# Altium schematic sheet 02 - EnergyManagementUnit.SchDoc: Energy Management Unit
size A4; DrawnBy: LS, OB, AB, AG, IM; Organization: Miromico; Revision: 3; SheetNumber: 3; SheetTotal: 5; SchemaTitle: Energy Management Unit
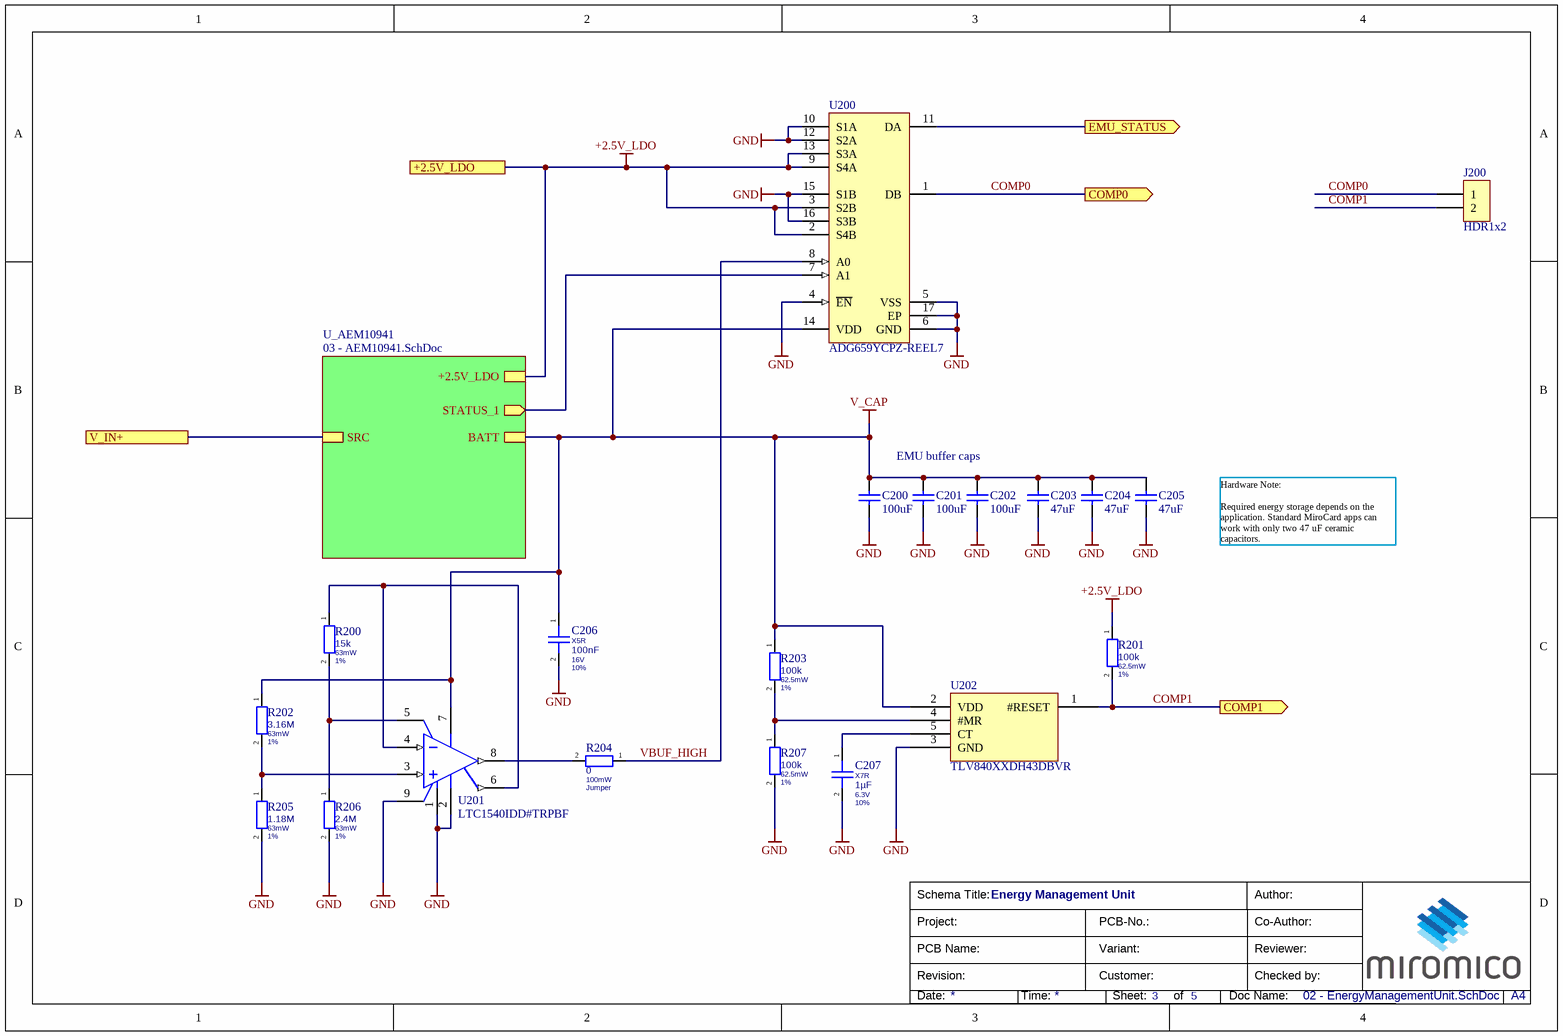
[diagram p0: 02 - EnergyManagementUnit.SchDoc]

## Parts
C200  value 100uF  [CAPC1206(3216)145_N]  (hidden comment: CAP 100uF 10V 1206(3216))
C201  value 100uF  [CAPC1206(3216)145_N]  (hidden comment: CAP 100uF 10V 1206(3216))
C202  value 100uF  [CAPC1206(3216)145_N]  (hidden comment: CAP 100uF 10V 1206(3216))
C203  value 47uF  [CAPC0805(2012)95_L]  (hidden comment: CAP 47uF 6.3V 0805(2012))
C204  value 47uF  [CAPC0805(2012)95_L]  (hidden comment: CAP 47uF 6.3V 0805(2012))
C205  value 47uF  [CAPC0805(2012)95_L]  (hidden comment: CAP 47uF 6.3V 0805(2012))
C206  Dielectric: X5R  Capacitance: 100nF  Voltage Rating: 16V  Tolerance: 10%  [CAPC0402(1005)60_L]  (hidden comment: GRM155R61C104KA88D)
C207  Dielectric: X7R  Capacitance: 1µF  Voltage Rating: 6.3V  Tolerance: 10%  [CAPC0402(1005)60_L]  (hidden comment: GRM155R70J105KA12J)
J200  HDR1x2  [HDR1x2]
R200  Resistance: 15k  Power Rating: 63mW  Tolerance: 1%  [RESC0402(1005)_L]  (hidden comment: PFR05S-153-FNH)
R201  Resistance: 100k  Power Rating: 62.5mW  Tolerance: 1%  [RESC0402(1005)_L]  (hidden comment: RMCF0402FT100K)
R202  Resistance: 3.16M  Power Rating: 63mW  Tolerance: 1%  [RESC0402(1005)_L]  (hidden comment: CRCW04023M16FKED)
R203  Resistance: 100k  Power Rating: 62.5mW  Tolerance: 1%  [RESC0402(1005)_L]  (hidden comment: RMCF0402FT100K)
R204  Resistance: 0  Power Rating: 100mW  Tolerance: Jumper  [RESC0603(1608)_L]  (hidden comment: RMCF0603ZT0R00)
R205  Resistance: 1.18M  Power Rating: 63mW  Tolerance: 1%  [RESC0402(1005)_L]  (hidden comment: RMCF0402FT1M18)
R206  Resistance: 2.4M  Power Rating: 63mW  Tolerance: 1%  [RESC0402(1005)_L]  (hidden comment: RMCF0402FT2M40)
R207  Resistance: 100k  Power Rating: 62.5mW  Tolerance: 1%  [RESC0402(1005)_L]  (hidden comment: RMCF0402FT100K)
U200  ADG659YCPZ-REEL7  [CP-16-4_L]
U201  LTC1540IDD#TRPBF  [LT-DD8_V]
U202  TLV840XXDH43DBVR  [SOT23-5 SOT-23-5]

## Sub-sheets
U_AEM10941 = 03 - AEM10941.SchDoc: STATUS_1 (out), SRC, +2.5V_LDO, BATT

## Ports
+2.5V_LDO, COMP0 (out), COMP1 (out), EMU_STATUS (out), V_IN+

## Nets
+2.5V_LDO: R201.1 U200.2(S4B) U200.3(S2B) U200.9(S4A) U200.13(S3A) ; port +2.5V_LDO, sheet U_AEM10941/+2.5V_LDO
GND: C200.1 C201.1 C202.1 C203.2 C204.2 C205.2 C206.2 C207.2 R205.2 R206.2 R207.2 U200.4(~{EN}) U200.5(VSS) U200.6(GND) U200.10(S1A) U200.12(S2A) U200.15(S1B) U200.16(S3B) U200.17(EP) U201.1(GND) U201.2(V-) U201.9(EP) U202.3(GND)
V_CAP: C200.2 C201.2 C202.2 C203.1 C204.1 C205.1 C206.1 R202.1 R203.1 U200.14(VDD) U201.7(V+) U202.2(VDD) ; sheet U_AEM10941/BATT
COMP0: J200.1 U200.1(DB) ; port COMP0
COMP1: J200.2 R201.2 U202.1(#RESET) ; port COMP1
EMU_STATUS: U200.11(DA) ; port EMU_STATUS
V_IN+: port V_IN+, sheet U_AEM10941/SRC
VBUF_HIGH: R204.1 U200.8(A0)
NetC207_1: C207.1 U202.5(CT)
NetR200_1: R200.1 U201.4(IN-) U201.6(REF)
NetR200_2: R200.2 R206.1 U201.5(HYST)
NetR202_2: R202.2 R205.1 U201.3(IN+)
NetR203_2: R203.2 R207.1 U202.4(#MR)
NetR204_2: R204.2 U201.8(OUT)
NetU200_7: U200.7(A1) ; sheet U_AEM10941/STATUS_1

## Notes on the sheet
- EMU buffer caps
- Hardware Note:
  Required energy storage depends on the application. Standard MiroCard apps can work with only two 47 uF ceramic capacitors.
- Schema Title:
- Project:
- PCB-No.:
- Author:
- Co-Author:
- Revision:
- PCB Name:
- Customer:
- Variant:
- Reviewer:
- Checked by:
- Date:
- Time:
- Sheet:
- of
- Doc Name:
- A4

## Library data of the parts
C200-C202 = CMP-LMK316BBJ107ML-T: CAP 100uF 10V ±20% 1206 (3216 Metric) Thickness 1.45mm SMD; Tolerance: Â±20%; Case-EIA: 1206; Case-Metric: 3216; Rated Voltage: 10 V; Technology: SMT; Max Thickness: 1.45 mm
C203-C205 = CMP-GRM219R60J476ME44D : CAP 47uF 6.3V ±20% 0805 (2012 Metric) Thickness 0.95mm SMD; Tolerance: Â±20%; Case-EIA: 0805; Case-Metric: 2012; Rated Voltage: 6.3 V; Technology: SMT; Max Thickness: 0.95 mm
C206 = CMP-00416-01: 0.1µF ±10% 16V Ceramic Capacitor X5R 0402 (1005 Metric); Manufacturer: Murata Electronics; ComponentLink1Description: Datasheet; Manufacturer Part Number: GRM155R61C104KA88D; Supplier 1: Digi-Key; Supplier Part Number 1: 490-5415-1-ND; Mount: Surface Mount; Case/Package: 0402; Case Code (Metric): 1005; Case Code (Imperial): 0402; Min Operating Temperature: -55°C; Max Operating Temperature: 85°C; Package Quantity: 1; Packaging: Tape and Reel; Termination: SMD/SMT; Voltage: 16V; Voltage Rating (DC): 16V; Length: 1mm; Width: 0.02inch; Height: 0.5mm; Thickness: 0.022inch; Depth: 0.5mm; Radiation Hardening: No; REACH SVHC: No SVHC; Lead Free: Lead Free
C207 = CMP-00441-03: 1µF ±10% 6.3V Ceramic Capacitor X7R 0402 (1005 Metric); Manufacturer: Murata Electronics; ComponentLink1Description: Datasheet; Manufacturer Part Number: GRM155R70J105KA12J; Supplier 1: Digi-Key; Supplier Part Number 1: 490-13339-1-ND; Mount: Surface Mount; Case/Package: 0402; Case Code (Metric): 1005; Case Code (Imperial): 0402; Weight: 0.000212oz; Min Operating Temperature: -55°C; Max Operating Temperature: 125°C; Packaging: Tape and Reel; Termination: SMD/SMT; Voltage Rating (DC): 6.3V; Package Quantity: 50000; Length: 0.039inch; Width: 0.02inch; Thickness: 0.022inch
J200 = HDR1x2-01: 1x2 Pin Header, 2.54mm; Properties: 1x2 Pin Terminal Header, 2.54mm; SchLibComponentName: HDR1x2
R200 = CMP-00468-01: 15 kOhms ±1% 0.063W, 1/16W Chip Resistor 0402 (1005 Metric)  Thick Film; Manufacturer: Delta Electronics/Cyntec; ComponentLink1Description: Datasheet; ComponentLink1URL: http://www.cyntec.com/upfile/products/download/RH000000NH%20_A3_PFR05.pdf; Manufacturer Part Number: PFR05S-153-FNH; Supplier 1: Digi-Key; Supplier Part Number 1: 2037-PFR05S-153-FNHCT-ND
R201 R203 R207 = CMP-00463-01: 100 kOhms ±1% 0,063W, 1/16W Chipwiderstand 0402 (1005 metrisch) AutomobilzulassungAEC-Q200 Dickschicht; Manufacturer: Stackpole Electronics Inc; Temperature Coefficient: 100ppm/°C; Max Power Dissipation: 63mW; ComponentLink1Description: Datasheet; ComponentLink1URL: https://www.seielect.com/catalog/sei-rmcf_rmcp.pdf; Manufacturer Part Number: RMCF0402FT100K; Supplier 1: Digi-Key; Supplier Part Number 1: RMCF0402FT100KCT-ND; Mount: Surface Mount; Case/Package: 0402; Case Code (Metric): 1005; Case Code (Imperial): 0402; Contact Plating: Tin,Matte; Min Operating Temperature: -55°C; Max Operating Temperature: 155°C; Packaging: Tape and Reel; Resistor Type: Thick Film; Number of Terminations: 2; Features: Automotive AEC-Q200; Length: 1mm; Width: 0.02inch; Height: 0.016inch; Depth: 0.5mm; Radiation Hardening: No; Military Standard: Not; Lead Free: Lead Free
R202 = CMP-00469-01: 3.16 MOhms ±1% 0.063W, 1/16W Chip Resistor 0402 (1005 Metric) Automotive AEC-Q200 Thick Film; Manufacturer: Vishay Dale; Voltage Rating: 50V; Temperature Coefficient: 100ppm/°C; ComponentLink1Description: Datasheet; ComponentLink1URL: https://www.vishay.com/docs/20035/dcrcwe3.pdf; Manufacturer Part Number: CRCW04023M16FKED; Supplier 1: Digi-Key; Supplier Part Number 1: 541-3.16MLCT-ND; Case/Package: 0402; Number of Pins: 2; Weight: 2.3E-05oz; Case Code (Metric): 1005; Case Code (Imperial): 0402; Contact Plating: Tin; Min Operating Temperature: -55°C; Max Operating Temperature: 155°C; Package Quantity: 10000; Packaging: Tape and Reel; Resistor Type: Thick Film; Number of Terminations: 2; Termination: SMD/SMT; Max Power Dissipation: 63mW; Voltage Rating (DC): 50V; Features: Automotive AEC-Q200; Length: 1mm; Width: 0.02inch; Height: 0.016inch; Depth: 0.5mm; Radiation Hardening: No; REACH SVHC: Unknown; Military Standard: Not; Lead Free: Lead Free
R204 = CMP-00472-01: 0 Ohms Jumper 0.1W, 1/10W Chip Resistor 0603 (1608 Metric) Automotive AEC-Q200 Thick Film; Manufacturer: Stackpole Electronics Inc; Current Rating: 1A; Working Voltage: 75V; ComponentLink1Description: Datasheet; ComponentLink1URL: https://www.seielect.com/catalog/sei-rmcf_rmcp.pdf; Manufacturer Part Number: RMCF0603ZT0R00; Supplier 1: Digi-Key; Supplier Part Number 1: RMCF0603ZT0R00CT-ND; Mount: Surface Mount; Case/Package: 0603; Case Code (Metric): 1608; Case Code (Imperial): 0603; Contact Plating: Tin,Matte; Min Operating Temperature: -55°C; Max Operating Temperature: 155°C; Packaging: Tape and Reel; Resistor Type: Thick Film; Number of Terminations: 2; Max Power Dissipation: 100mW; Features: Automotive AEC-Q200; Length: 1.55mm; Width: 0.031inch; Height: 0.022inch; Depth: 0.8mm; Radiation Hardening: No; Military Standard: Not; Lead Free: Lead Free
R205 = CMP-00470-01: 1.18 MOhms ±1% 0.063W, 1/16W Chip Resistor 0402 (1005 Metric) Automotive AEC-Q200 Thick Film; Manufacturer: Stackpole Electronics Inc; Temperature Coefficient: 200ppm/°C; ComponentLink1Description: Datasheet; ComponentLink1URL: https://www.seielect.com/catalog/sei-rmcf_rmcp.pdf; Manufacturer Part Number: RMCF0402FT1M18; Supplier 1: Digi-Key; Supplier Part Number 1: RMCF0402FT1M18CT-ND; Mount: Surface Mount; Case/Package: 0402; Contact Plating: Tin,Matte; Min Operating Temperature: -55°C; Max Operating Temperature: 155°C; Packaging: Tape and Reel; Resistor Type: Thick Film; Package Quantity: 10000; Number of Terminations: 2; Max Power Dissipation: 63mW; Features: Automotive AEC-Q200; Length: 0.039inch; Width: 0.02inch; Height: 0.016inch; Radiation Hardening: No
R206 = CMP-00471-01: 2.4 MOhms ±1% 0.063W, 1/16W Chip Resistor 0402 (1005 Metric) Automotive AEC-Q200 Thick Film; Manufacturer: Stackpole Electronics Inc; Temperature Coefficient: 200ppm/°C; ComponentLink1Description: Datasheet; ComponentLink1URL: https://www.seielect.com/catalog/sei-rmcf_rmcp.pdf; Manufacturer Part Number: RMCF0402FT2M40; Supplier 1: Digi-Key; Supplier Part Number 1: RMCF0402FT2M40CT-ND; Mount: Surface Mount; Case/Package: 0402; Contact Plating: Tin,Matte; Min Operating Temperature: -55°C; Max Operating Temperature: 155°C; Packaging: Tape and Reel; Resistor Type: Thick Film; Package Quantity: 10000; Number of Terminations: 2; Max Power Dissipation: 63mW; Features: Automotive AEC-Q200; Length: 0.039inch; Width: 0.02inch; Height: 0.016inch; Radiation Hardening: No
U200 = CMP-0798-00243-1: 3 V / 5 V / +/-5 V CMOS 4-Channel Analog Multiplexer, -40 to 85 degC, 16-pin QFN (CP-16-4), Reel; Manufacturer: Analog Devices; Ron (ohms): 45; Max Analog Signal Range: Vss to Vdd; t transition (s): 80n; Bandwidth (Hz): 400M; Supply V Guar Performance: Dual_(+/-5V), Single_(+3.3V), Single_(+3V), Single_(+5V); DatasheetVersion: Rev. B; PackageVersion: 010606-0, 01/2006; PackageReference: CP-16-4; Packing: Reel; Mounting Technology: Surface Mount; ComponentLink3URL: http://www.analog.com/static/imported-files/packages/46009454504174339653421710019CP_16_4.pdf; ComponentLink2Description: Datasheet; ComponentLink3Description: Package Specification; Code_JEDEC: MO-220-VGGC; PackageDescription: 16-Pin Lead Frame Chip Scale Package, Body 4 x 4 mm, Pitch 0.65 mm; ComponentLink1Description: Manufacturer URL; ComponentLink2URL: http://www.analog.com/static/imported-files/data_sheets/ADG658_659.pdf; ComponentLink1URL: http://www.analog.com/en/index.html; PartNumber: ADG659YCPZ-REEL7
U201 = CMP-0360-00091-2: Nanopower Comparator with Reference, 1 Channel, 2 to 11 V, -40 to +85 degC, 8-pin Plastic DFN (DD8), Tape and Reel; Manufacturer: Linear Technology; Channels (#): 1; Vos (mV) Guaranteed: 12; Vs Min (V): 2; Prop Delay (us): 50; Supply Current (uA) Typical: 0.3; Supply Voltage Range: 2 to 11 V; Vs Max (V): 11; Supply Current (uA) Guaranteed: 0.68; ComponentLink2URL: http://cds.linear.com/docs/en/datasheet/1540fas.pdf; PackageDescription: 8-Pin Plastic DFN, Body 3 Ã— 3 mm, Pitch 0.5 mm; ComponentLink1URL: http://www.linear.com/; Vos (mV) Typical: 12; Generic Part Number: LTC1540; ComponentLink3Description: Package Specification; Features: Reference, Comparator; ComponentLink3URL: http://cds.linear.com/docs/en/packaging/DFN_8_05-08-1698.pdf; PartNumber: LTC1540IDD#TRPBF; DatasheetVersion: Rev A; RoHS: Y; Mounting Technology: Surface Mount; Code_JEDEC: M0-229; ComponentLink2Description: Datasheet; PackageReference: DD8; ComponentLink1Description: Manufacturer URL
U202 = CMP-00473-01: Low-voltage supervisor with adjustable-reset time delay and manual reset; Manufacturer: Texas Instruments; ComponentLink1Description: Datasheet; ComponentLink1URL: https://www.ti.com/lit/ds/symlink/tlv840.pdf?ts=1604051563341&ref_url=https%253A%252F%252Fwww.ti.com%252Fproduct%252FTLV840; Manufacturer Part Number: TLV840XXDH43DBVR; Supplier 1: Texas Instruments; Supplier Part Number 1: TLV840XXDH43DBVR